# EAGLE design PSU (EAGLE 7.5.0)
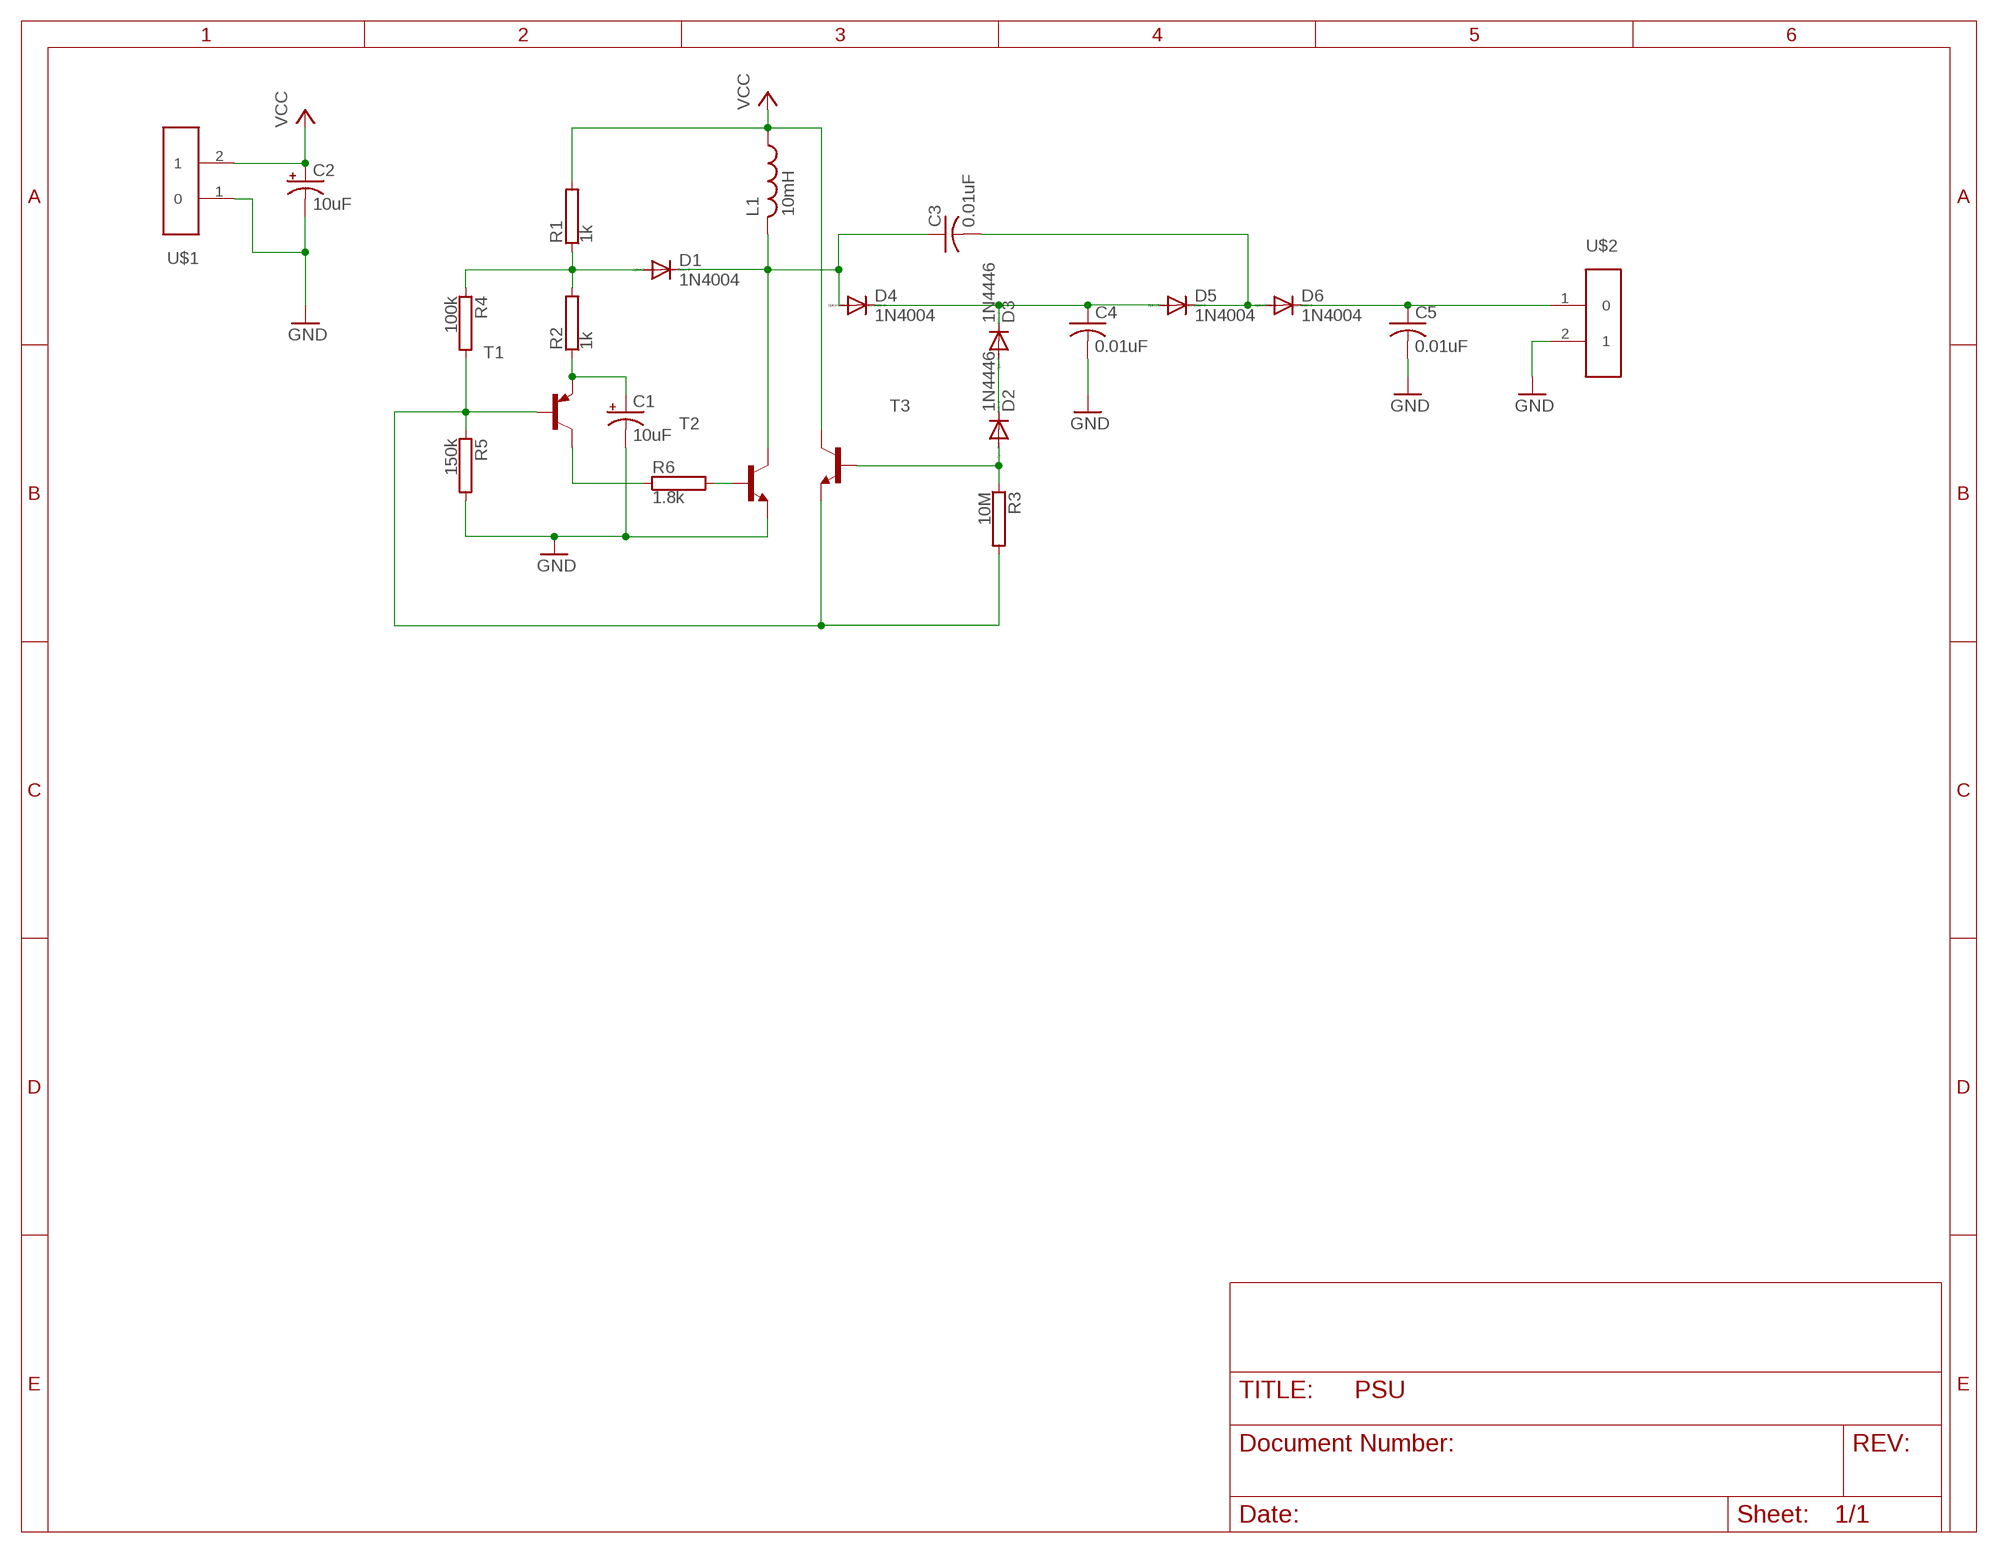
[diagram p0: schematic, sheet 1]

## Parts
C1  10uF  CPOL-USE2.5-5  [E2,5-5]
C2  10uF  CPOL-USE2.5-5  [E2,5-5]
C3  0.01uF  C-US075-032X103  [C075-032X103]
C4  0.01uF  C-US075-032X103  [C075-032X103]
C5  0.01uF  C-US075-032X103  [C075-032X103]
D1  1N4004  [DO41-10]
D2  1N4446  [DO35-10]
D3  1N4446  [DO35-10]
D4  1N4004  [DO41-10]
D5  1N4004  [DO41-10]
D6  1N4004  [DO41-10]
L1  10mH  L-US0207/5V  [0207/5V]
R1  1k  RRS1/4  [RS1/4]
R2  1k  RRS1/4  [RS1/4]
R3  10M  RRS1/4  [RS1/4]
R4  100k  RRS1/4  [RS1/4]
R5  150k  RRS1/4  [RS1/4]
R6  1.8k  RRS1/4  [RS1/4]
T1  2N4403-PNP-TO92-EBC  [TO92-EBC]
T2  MPSA42-NPN-TO92-EBC  [TO92-EBC]
T3  MPSA18-NPN-TO92-EBC  [TO92-EBC]
U$1  ED2609  [ED2609]
U$2  ED2609  [ED2609]

## Nets
GND: C1.- C2.- C4.2 C5.2 R5.2 T2.E U$1.1 U$2.2
N$1: D1.A R1.1 R2.2 R4.1
N$2: D2.A R3.1 T3.B
N$3: R3.2 R4.2 R5.1 T1.B T3.E
N$4: C1.+ R2.1 T1.E
N$5: D2.C D3.A
N$6: R6.2 T2.B
N$7: C3.1 D1.C D4.A L1.2 T2.C
N$8: R6.1 T1.C
N$9: C4.1 D3.C D4.C D5.A
N$11: C3.2 D5.C D6.A
N$12: C5.1 D6.C U$2.1
VCC: C2.+ L1.1 R1.2 T3.C U$1.2

## Library data of the parts
C1 C2 = rcl:CPOL-US: POLARIZED CAPACITOR, American symbol
C3-C5 = resistor:C-US: CAPACITOR, American symbol
D1 D4-D6 = diode:1N4004: DIODE general purpose rectifier, 1 A
D2 D3 = diode:1N4446: DIODE high speed (Philips)
L1 = resistor:L-US: INDUCTOR, American symbol
R1-R6 = resistor-power:R: Power Resitor; MF: OHMITE; MPN: RRS1K0; OC_FARNELL: unknown; OC_NEWARK: 01F7661
T1 = transistor-neu-to92:*-PNP-: PNP Transistror
T2 T3 = transistor:*-NPN-: NPN Transistror BF959 corrected 2008.03.06
U$1 U$2 = psu:ED2609

## Board
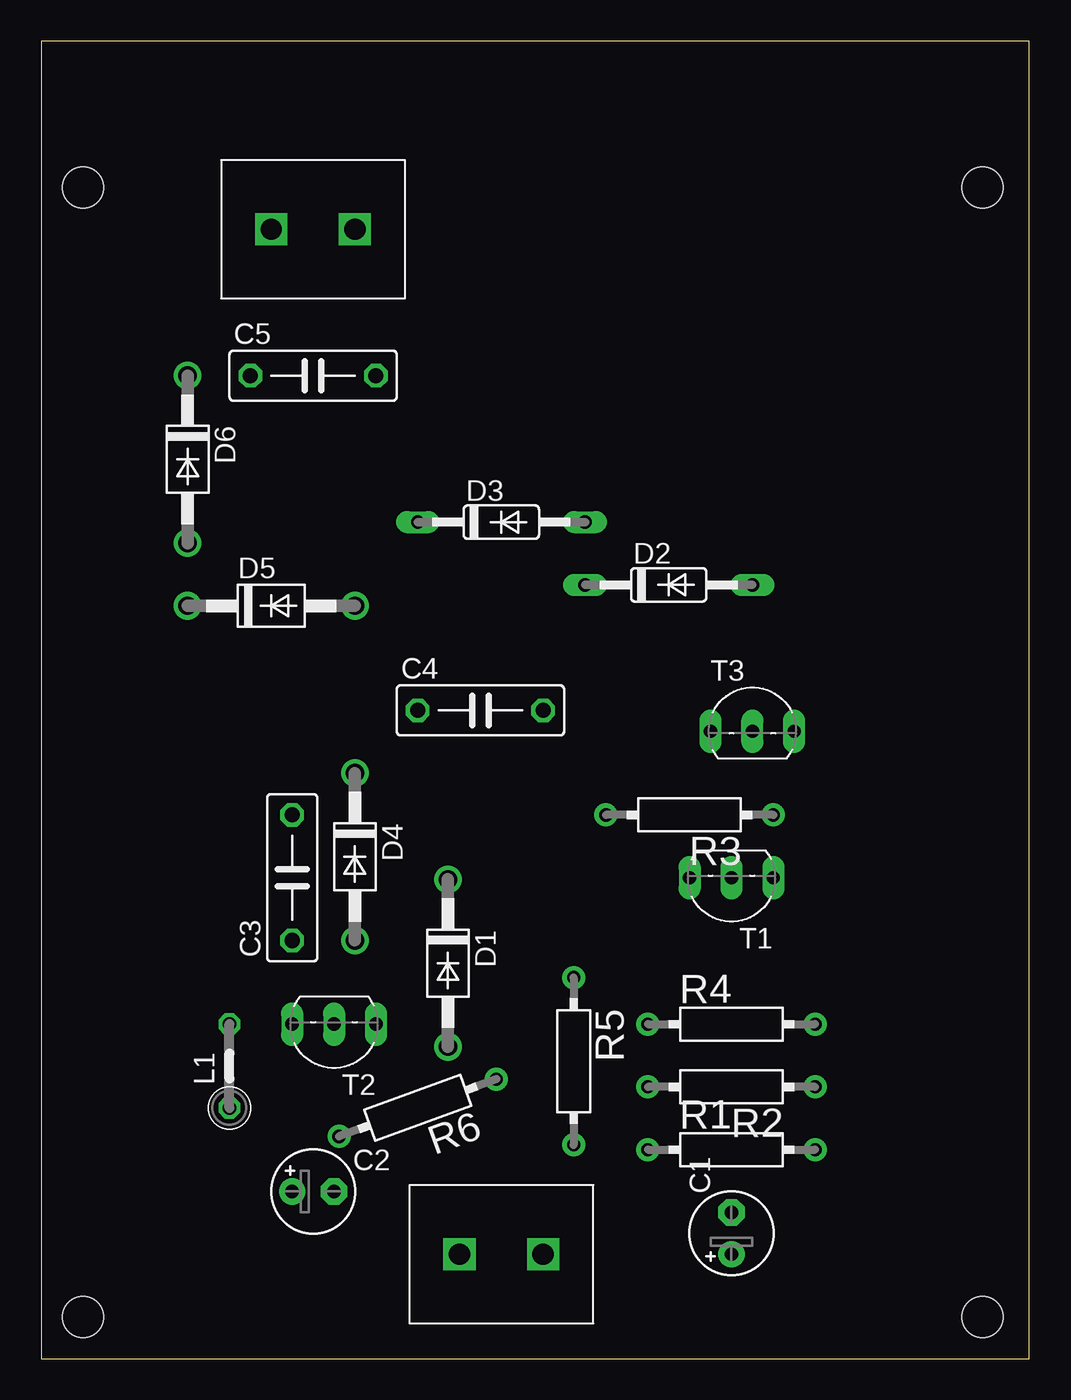
[diagram p1: board, top side]
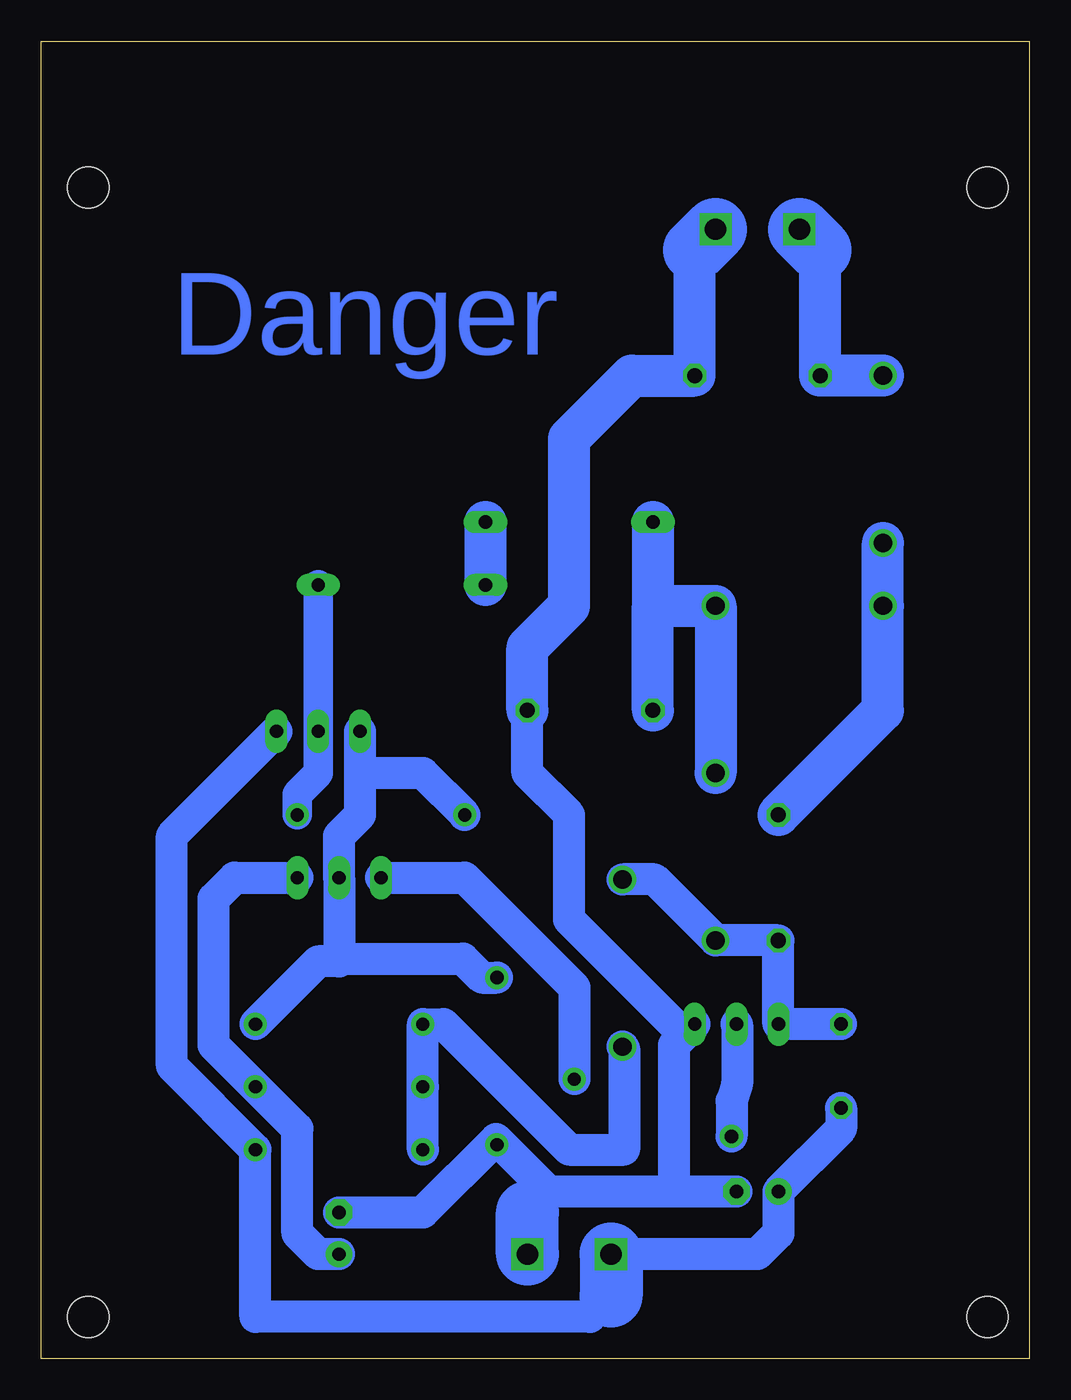
[diagram p2: board, bottom side, seen from below]

Size 60 x 80 mm. Coordinates in mm from the lower left corner, seen from the top.
Outline: 0,0 60,0 60,80 0,80 0,0
Copper layers (1*16): Top 0.035mm / dielectric 1.5mm / Bottom 0.035mm
Design rules "default": minimum track width 10mil, minimum drill 24mil, track to track 8mil, track to pad 8mil, pad to pad 8mil, via to via 8mil, smd to smd 8mil, copper to edge 40mil, drill to drill 8mil, minimum pad ring 10mil, minimum via ring 8mil, stop-mask expansion 4mil, vias tented up to drill 0mil, thermal gap 10mil
Holes 2.5 mm at 2.54,2.54 57.15,2.54 57.15,71.12 2.54,71.12

### Footprints (pad centres in the part's own frame; a part is rotated, then mirrored left to right if it is on the bottom)
E2,5-5 = drill 0.813 pad 1.6: + -1.27,0 | drill 0.813 pad 1.6 octagon: - 1.27,0
C075-032X103 = drill 0.914 octagon: 1 -3.81,0; 2 3.81,0
DO41-10 = drill 1.118: A 5.08,0; C -5.08,0
DO35-10 = drill 0.813 long: A 5.08,0; C -5.08,0
0207/5V = drill 0.813 octagon: 1 -2.54,0; 2 2.54,0
RS1/4 = drill 0.8 pad 1.4: 1 -5.08,0; 2 5.08,0
TO92-EBC = drill 0.813 long: B 0,-1.27; C 2.54,-1.27; E -2.54,-1.27
ED2609 = drill 1.3 square: 1 0,0; 2 5.08,0

### Placement (x,y rotation side)
C1  41.91,7.62 90 top
C2  16.51,10.16 0 top
C3  15.24,29.21 90 top
C4  26.67,39.37 0 top
C5  16.51,59.69 0 top
D1  24.7,24.03 270 top
D2  38.1,46.99 0 top
D3  27.94,50.8 0 top
D4  19.05,30.48 270 top
D5  13.97,45.72 0 top
D6  8.89,54.61 270 top
L1  11.43,17.78 90 top
R1  41.91,12.7 0 top
R2  41.91,16.51 180 top
R3  39.37,33.02 180 top
R4  41.91,20.32 0 top
R5  32.33,18.07 270 top
R6  22.86,15.24 200 top
T1  41.91,27.94 180 top
T2  17.78,19.05 180 top
T3  43.18,39.37 0 top
U$1  30.48,6.35 180 top
U$2  13.97,68.58 0 top

### Tracks (layer width: path | path; a pad name or v marks a point on that pad's centre or on a via)
GND
  Bottom 1.27: R5.2 32.38,13.34 | T2.E 21.59,20.32
  Bottom 1.93: 30.48,8.89 29.21,10.16 | 29.21,10.16 21.59,10.16 | 21.59,10.16 C2.- | T2.E 21.59,19.05 21.59,10.16 | 29.21,10.16 32.38,13.34 36.83,8.89 C1.- | 21.59,20.32 27.94,26.67 27.94,33.02 30.48,35.56 C4.2
  Bottom 2.54: 20.32,67.31 C5.2 24.13,59.69 27.94,55.88 27.94,45.72 30.48,43.18 C4.2
  Bottom 3.81: U$1.1 30.48,8.89 | 20.32,67.31 U$2.2
N$1
  Bottom 1.93: R1.1 R2.2 R4.1 35.56,20.32 27.94,12.7 24.6,12.7 24.6,18.85 D1.A
N$2
  Bottom 1.778: R3.1 44.45,34.29 43.18,35.56 T3.B D2.A
N$3
  Bottom 1.93: 41.91,24.13 43.18,24.13 R4.2 | 41.91,24.13 T1.B 41.91,31.75 40.64,33.02 40.64,35.56 | 40.64,35.56 T3.E | R3.2 36.83,35.56 40.64,35.56 | 41.91,24.13 41.74,24.3 34.4,24.3 33.25,23.15 R5.1
N$4
  Bottom 1.93: C1.+ 43.18,6.35 44.45,7.62 44.45,13.97 R2.1 49.53,19.05 49.53,27.94 48.26,29.21 T1.E
N$5
  Bottom 2.54: D2.C D3.A
N$6
  Bottom 1.93: T2.B 17.75,20.29 17.75,16.7 18.09,15.66 R6.2
N$7
  Bottom 1.93: L1.2 T2.C C3.1 D4.A 22.76,29.11 D1.C
N$8
  Bottom 1.93: T1.C 34.29,29.21 27.63,22.55 R6.1
N$9
  Bottom 2.54: C4.1 22.86,45.72 | 22.86,45.72 D5.A D4.C | D3.C 22.86,45.72
N$11
  Bottom 2.54: C3.2 8.89,39.37 D5.C D6.A
N$12
  Bottom 2.54: D6.C C5.1 12.7,67.31
  Bottom 3.81: 12.7,67.31 U$2.1
VCC
  Bottom 1.93: L1.1 11.43,13.97 C2.+ 15.24,7.62 16.51,6.35 U$1.2 | 25.4,3.81 26.67,2.54 46.99,2.54 R1.2 52.07,17.78 52.07,31.75 T3.C
  Bottom 3.81: U$1.2 25.4,3.81

### Text on the board
Bottom: Danger